# EAGLE schematic EEG_64 (EAGLE 6.6.0)
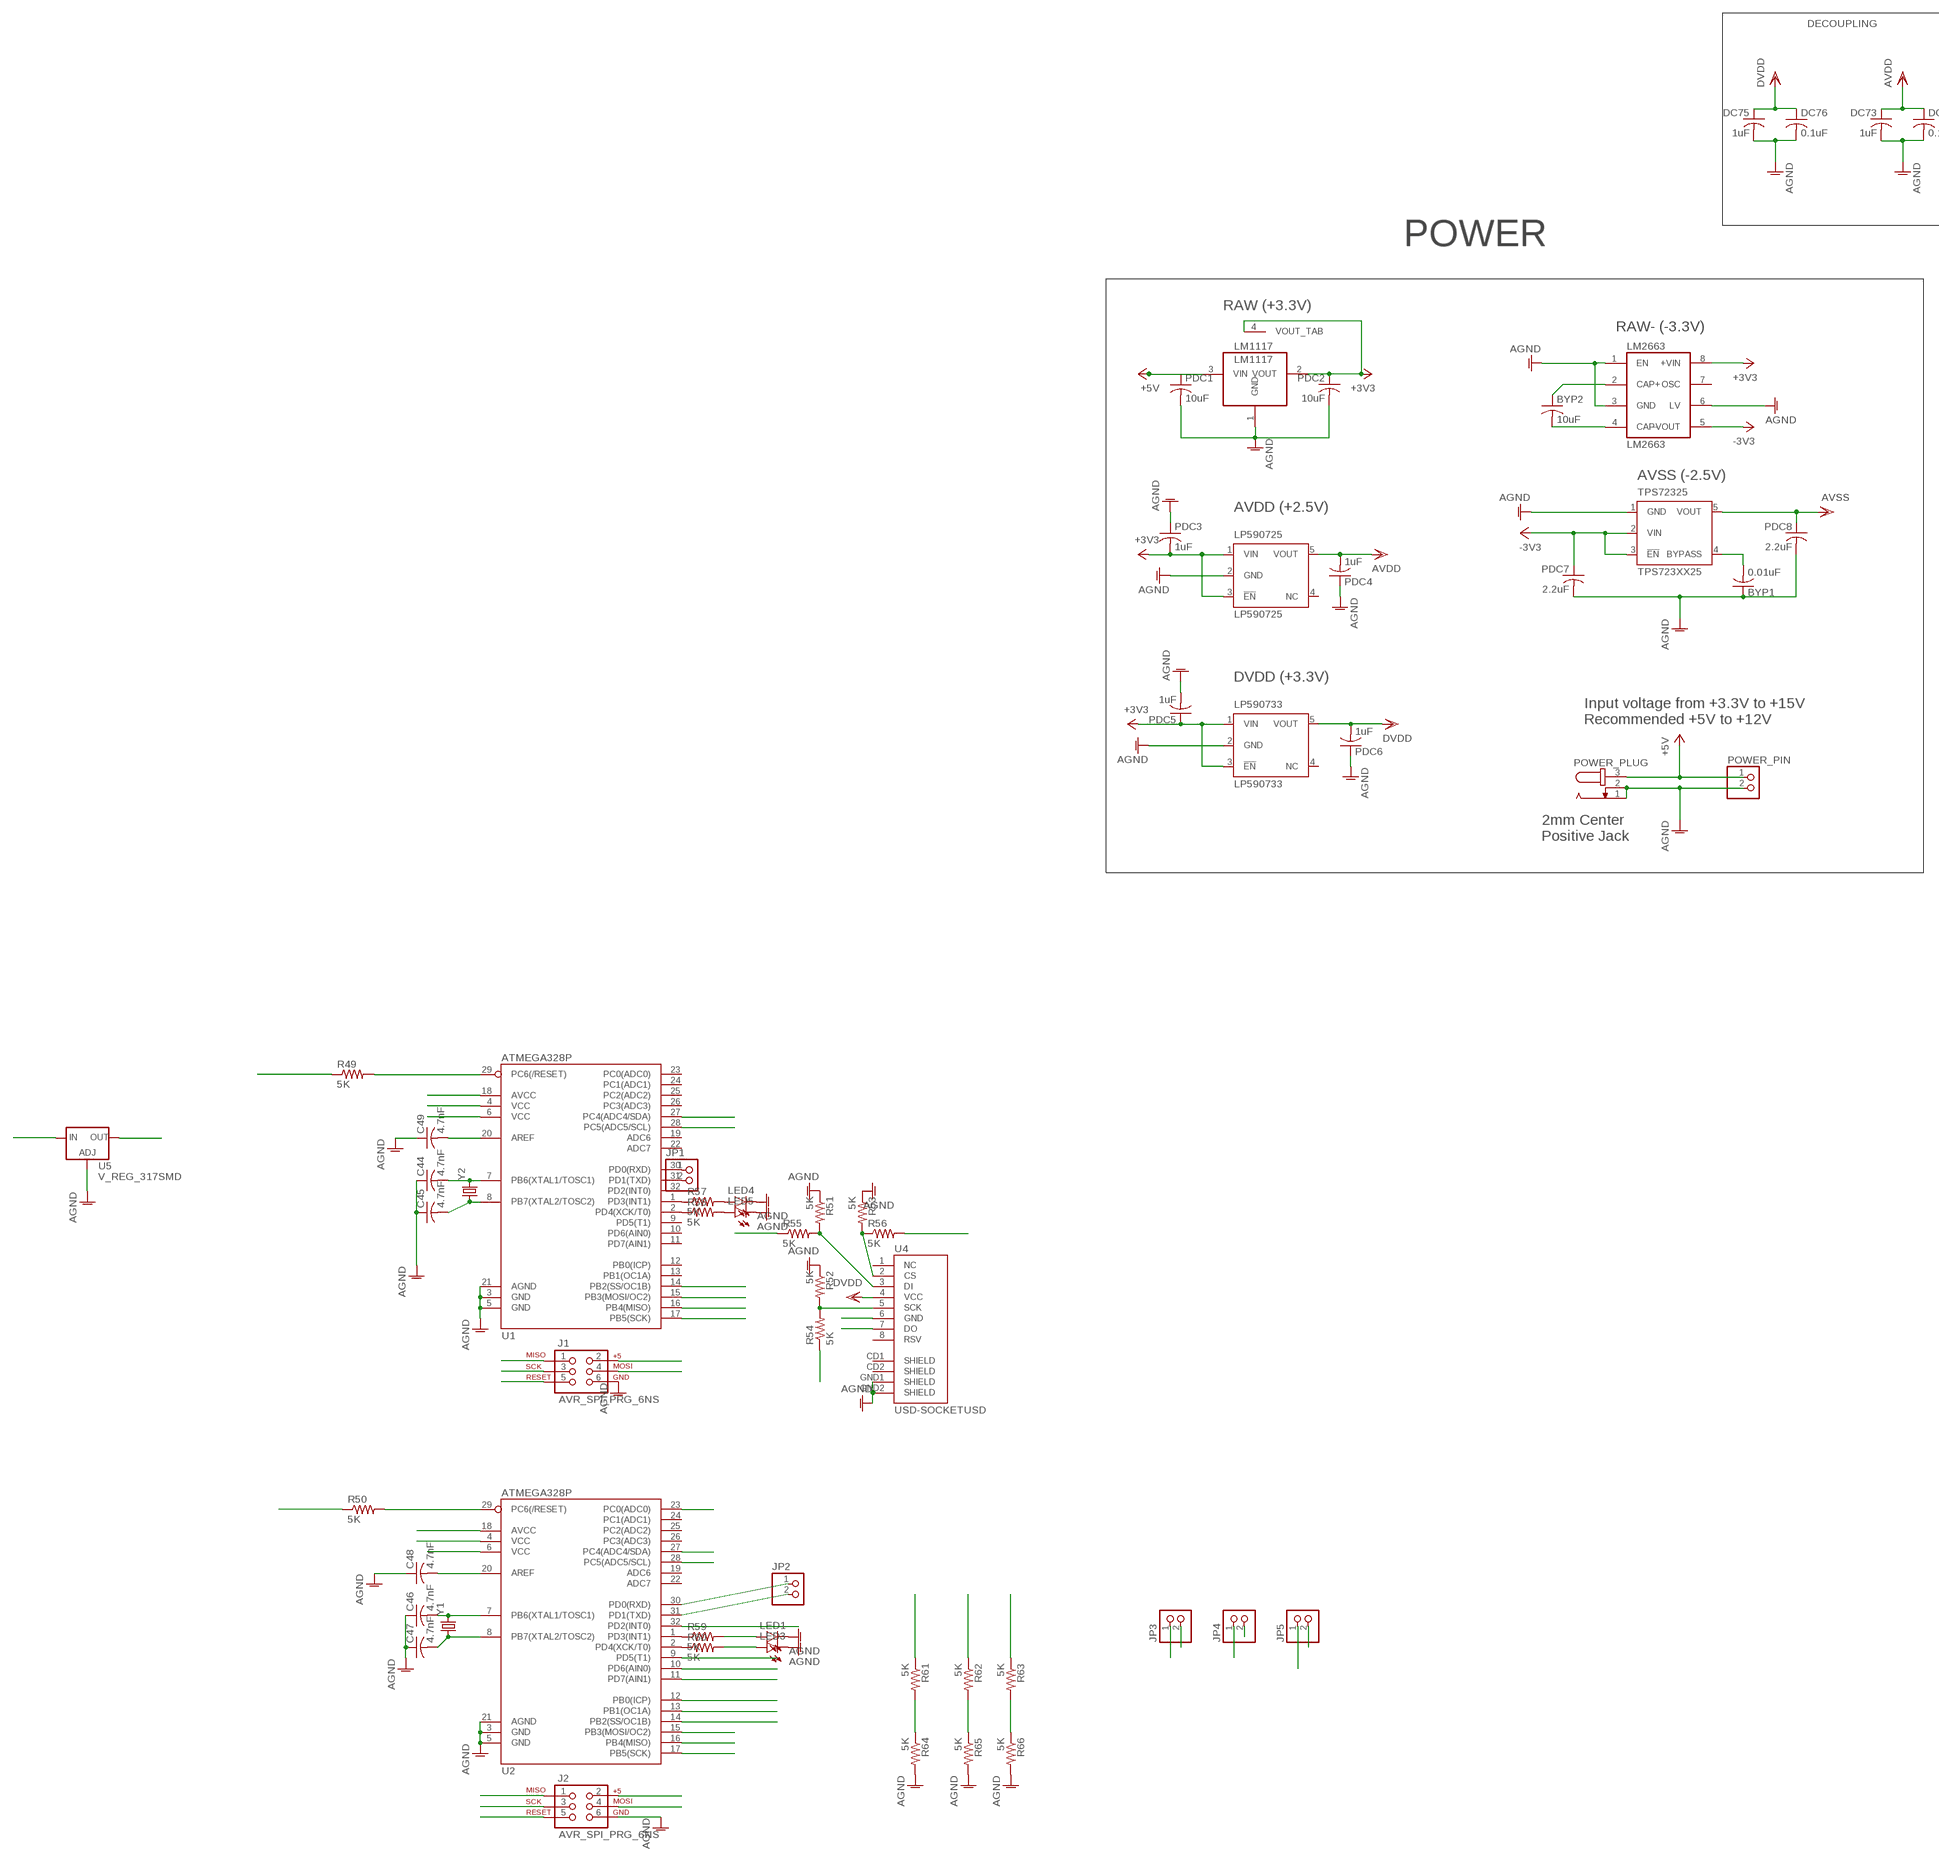
[diagram p0: schematic, sheet 1, part 1 of 3]
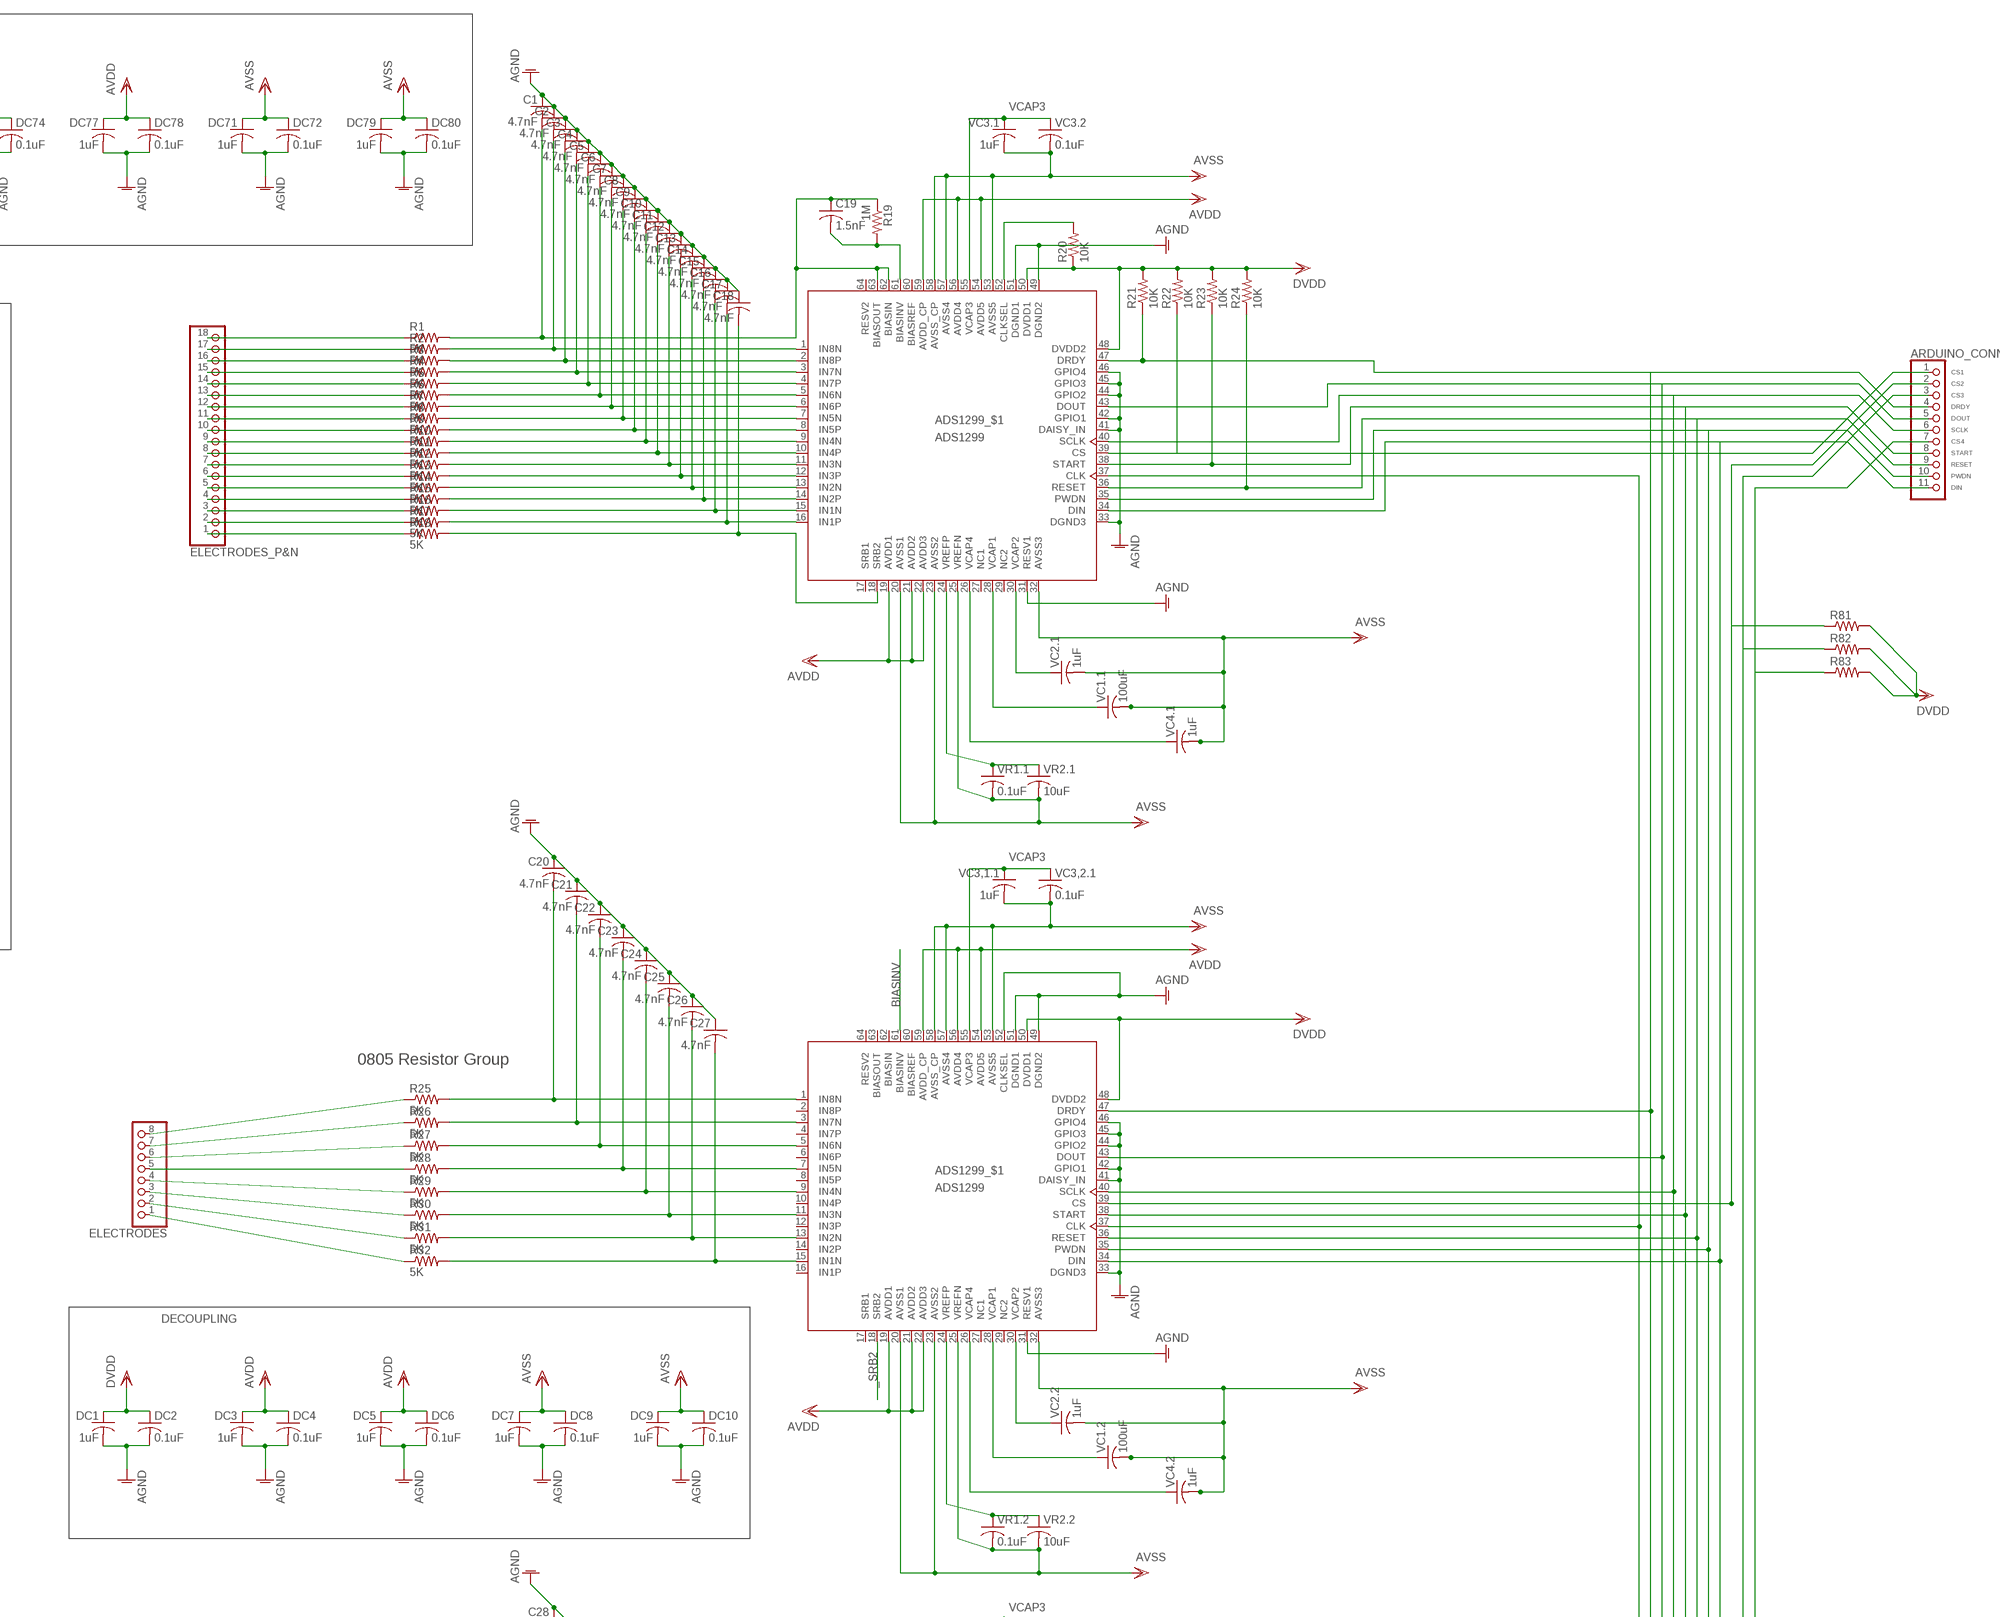
[diagram p1: schematic, sheet 1, part 2 of 3]
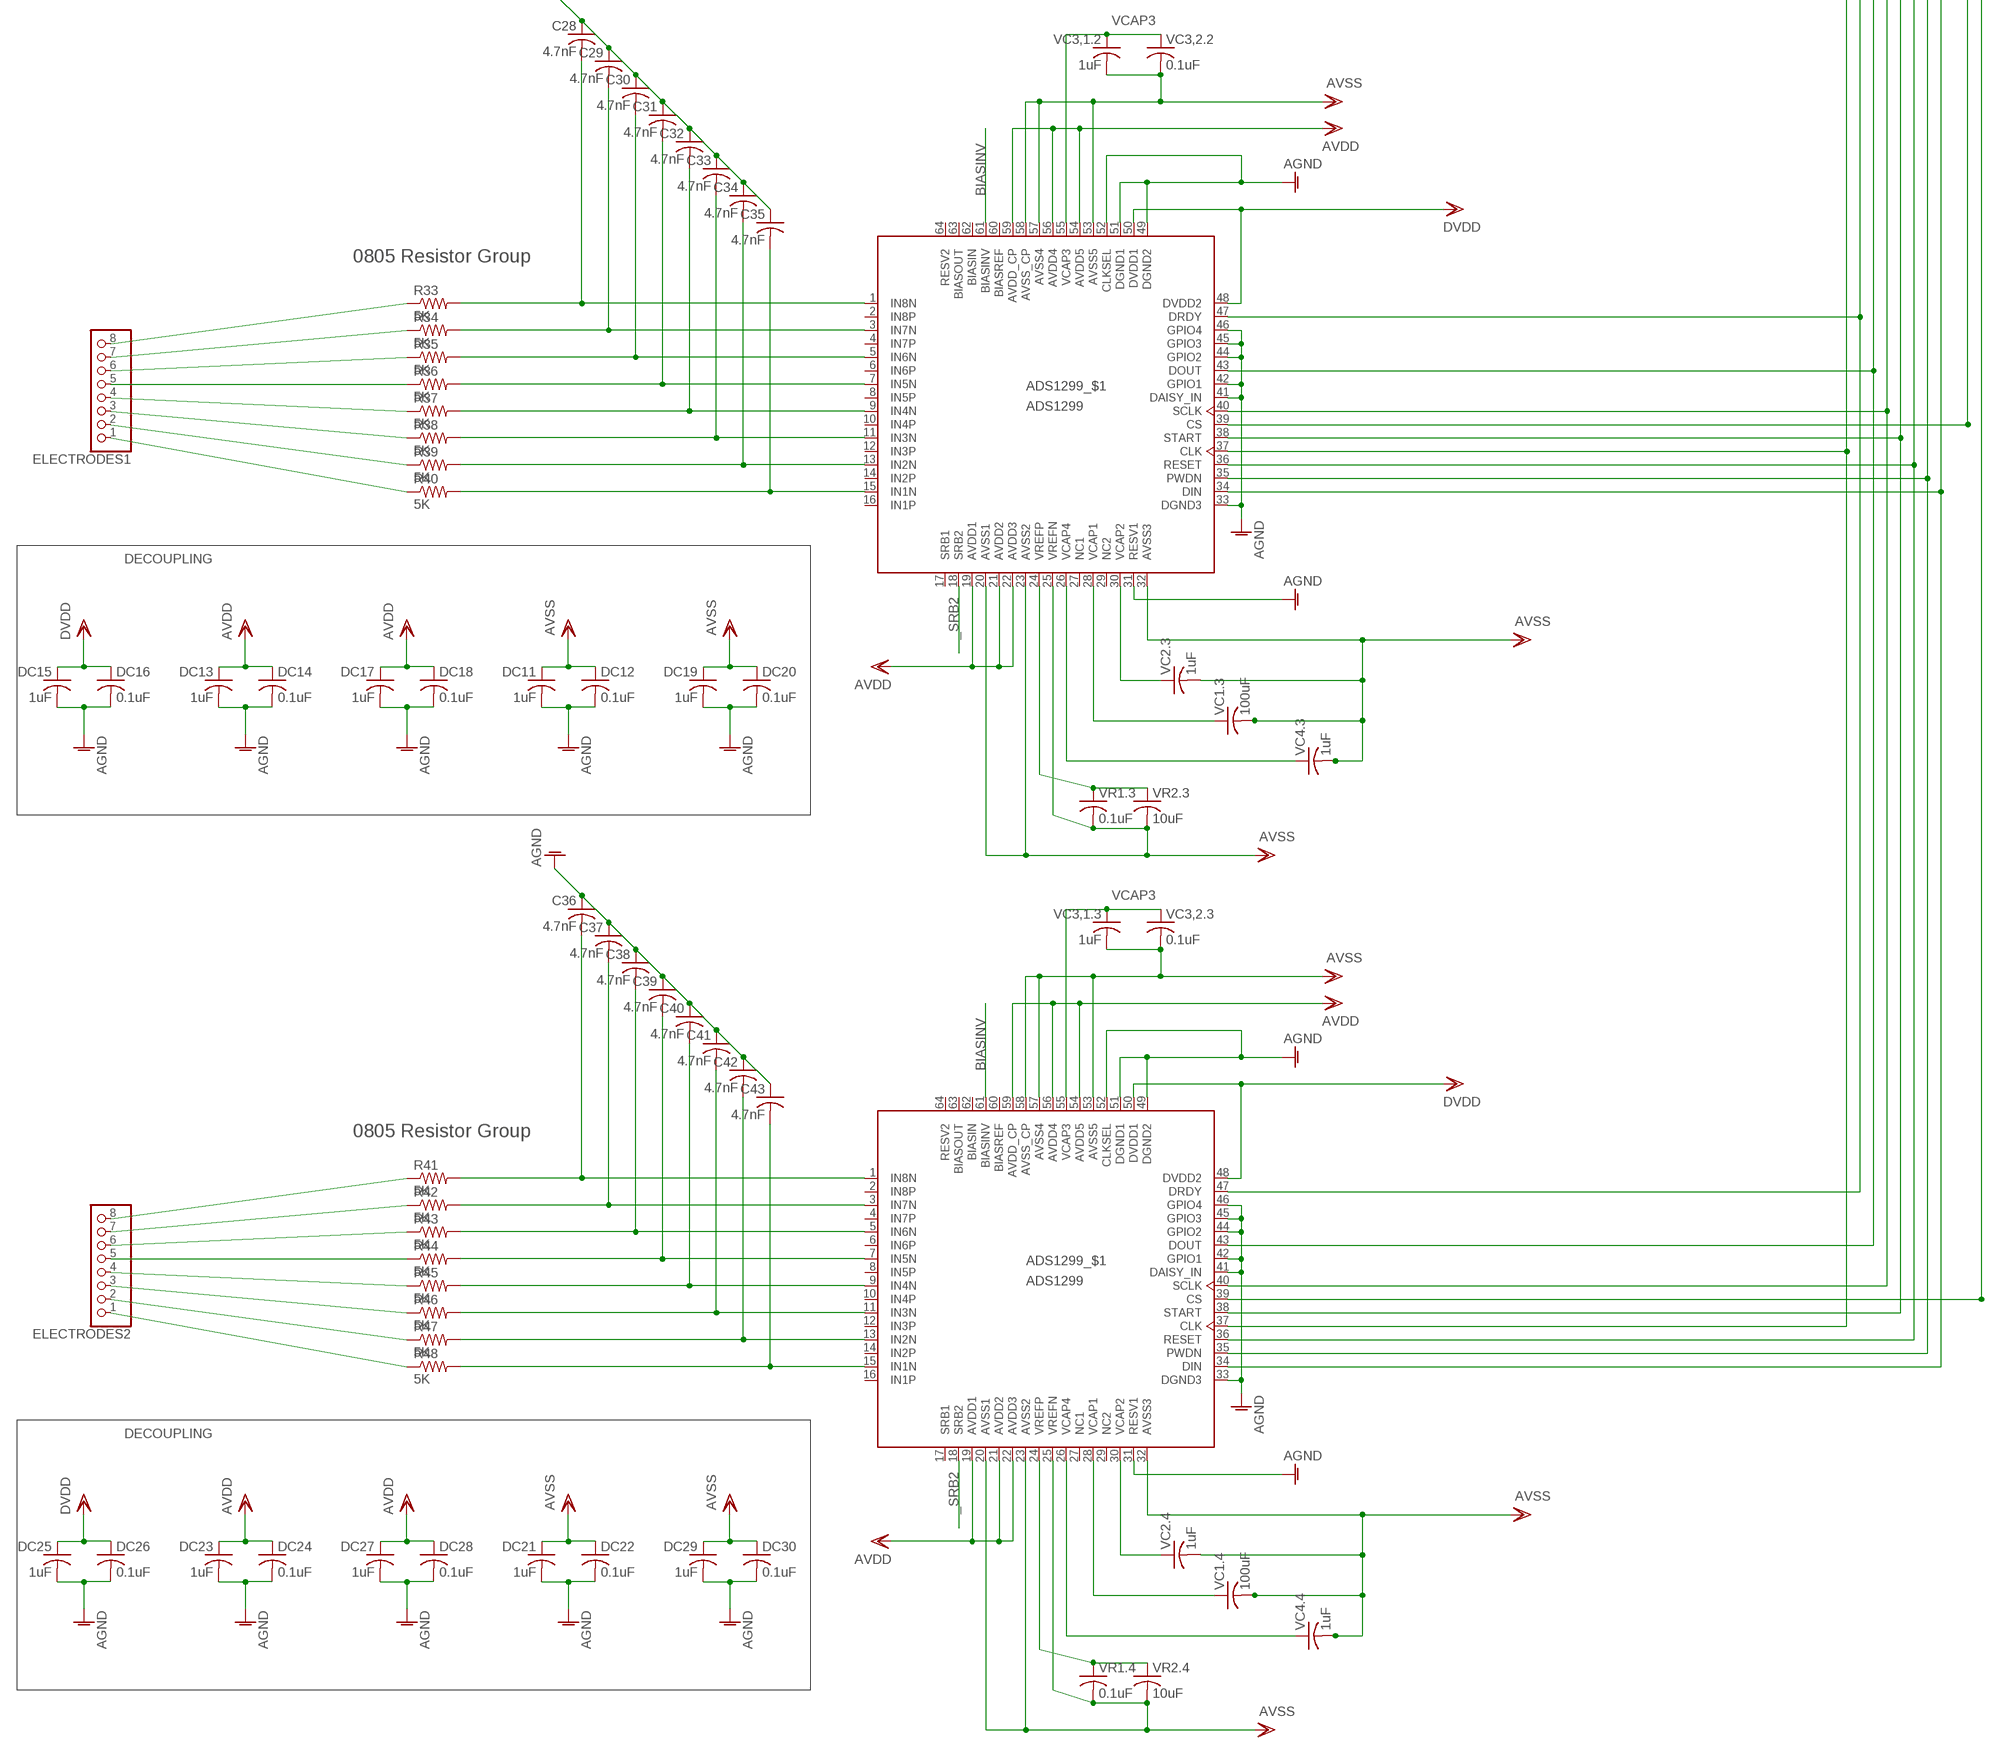
[diagram p2: schematic, sheet 1, part 3 of 3]

## Parts
ADS1  ADS1299  [PAG_S-PQFP-G64]
ADS2  ADS1299  [PAG_S-PQFP-G64]
ADS3  ADS1299  [PAG_S-PQFP-G64]
ADS4  ADS1299  [PAG_S-PQFP-G64]
ARDUINO_CONN  PINHD-1X11  [1X11]
BYP1  0.01uF  C-USC0603  [C0603]
BYP2  10uF  C-USC0603  [C0603]
C1  4.7nF  C-USC0603  [C0603]
C2  4.7nF  C-USC0603  [C0603]
C3  4.7nF  C-USC0603  [C0603]
C4  4.7nF  C-USC0603  [C0603]
C5  4.7nF  C-USC0603  [C0603]
C6  4.7nF  C-USC0603  [C0603]
C7  4.7nF  C-USC0603  [C0603]
C8  4.7nF  C-USC0603  [C0603]
C9  4.7nF  C-USC0603  [C0603]
C10  4.7nF  C-USC0603  [C0603]
C11  4.7nF  C-USC0603  [C0603]
C12  4.7nF  C-USC0603  [C0603]
C13  4.7nF  C-USC0603  [C0603]
C14  4.7nF  C-USC0603  [C0603]
C15  4.7nF  C-USC0603  [C0603]
C16  4.7nF  C-USC0603  [C0603]
C17  4.7nF  C-USC0603  [C0603]
C18  4.7nF  C-USC0603  [C0603]
C19  1.5nF  C-USC0603  [C0603]
C20  4.7nF  C-USC0603  [C0603]
C21  4.7nF  C-USC0603  [C0603]
C22  4.7nF  C-USC0603  [C0603]
C23  4.7nF  C-USC0603  [C0603]
C24  4.7nF  C-USC0603  [C0603]
C25  4.7nF  C-USC0603  [C0603]
C26  4.7nF  C-USC0603  [C0603]
C27  4.7nF  C-USC0603  [C0603]
C28  4.7nF  C-USC0603  [C0603]
C29  4.7nF  C-USC0603  [C0603]
C30  4.7nF  C-USC0603  [C0603]
C31  4.7nF  C-USC0603  [C0603]
C32  4.7nF  C-USC0603  [C0603]
C33  4.7nF  C-USC0603  [C0603]
C34  4.7nF  C-USC0603  [C0603]
C35  4.7nF  C-USC0603  [C0603]
C36  4.7nF  C-USC0603  [C0603]
C37  4.7nF  C-USC0603  [C0603]
C38  4.7nF  C-USC0603  [C0603]
C39  4.7nF  C-USC0603  [C0603]
C40  4.7nF  C-USC0603  [C0603]
C41  4.7nF  C-USC0603  [C0603]
C42  4.7nF  C-USC0603  [C0603]
C43  4.7nF  C-USC0603  [C0603]
C44  4.7nF  C-USC0603  [C0603]
C45  4.7nF  C-USC0603  [C0603]
C46  4.7nF  C-USC0603  [C0603]
C47  4.7nF  C-USC0603  [C0603]
C48  4.7nF  C-USC0603  [C0603]
C49  4.7nF  C-USC0603  [C0603]
DC1  1uF  C-USC0603  [C0603]
DC2  0.1uF  C-USC0603  [C0603]
DC3  1uF  C-USC0603  [C0603]
DC4  0.1uF  C-USC0603  [C0603]
DC5  1uF  C-USC0603  [C0603]
DC6  0.1uF  C-USC0603  [C0603]
DC7  1uF  C-USC0603  [C0603]
DC8  0.1uF  C-USC0603  [C0603]
DC9  1uF  C-USC0603  [C0603]
DC10  0.1uF  C-USC0603  [C0603]
DC11  1uF  C-USC0603  [C0603]
DC12  0.1uF  C-USC0603  [C0603]
DC13  1uF  C-USC0603  [C0603]
DC14  0.1uF  C-USC0603  [C0603]
DC15  1uF  C-USC0603  [C0603]
DC16  0.1uF  C-USC0603  [C0603]
DC17  1uF  C-USC0603  [C0603]
DC18  0.1uF  C-USC0603  [C0603]
DC19  1uF  C-USC0603  [C0603]
DC20  0.1uF  C-USC0603  [C0603]
DC21  1uF  C-USC0603  [C0603]
DC22  0.1uF  C-USC0603  [C0603]
DC23  1uF  C-USC0603  [C0603]
DC24  0.1uF  C-USC0603  [C0603]
DC25  1uF  C-USC0603  [C0603]
DC26  0.1uF  C-USC0603  [C0603]
DC27  1uF  C-USC0603  [C0603]
DC28  0.1uF  C-USC0603  [C0603]
DC29  1uF  C-USC0603  [C0603]
DC30  0.1uF  C-USC0603  [C0603]
DC71  1uF  C-USC0603  [C0603]
DC72  0.1uF  C-USC0603  [C0603]
DC73  1uF  C-USC0603  [C0603]
DC74  0.1uF  C-USC0603  [C0603]
DC75  1uF  C-USC0603  [C0603]
DC76  0.1uF  C-USC0603  [C0603]
DC77  1uF  C-USC0603  [C0603]
DC78  0.1uF  C-USC0603  [C0603]
DC79  1uF  C-USC0603  [C0603]
DC80  0.1uF  C-USC0603  [C0603]
ELECTRODES  PINHD-1X8  [1X08]
ELECTRODES1  PINHD-1X8  [1X08]
ELECTRODES2  PINHD-1X8  [1X08]
ELECTRODES_P&N  PINHD-1X18  [1X18]
J1  AVR_SPI_PRG_6NS  [2X3-NS]
J2  AVR_SPI_PRG_6NS  [2X3-NS]
JP1  PINHD-1X2  [1X02]
JP2  PINHD-1X2  [1X02]
JP3  PINHD-1X2  [1X02]
JP4  PINHD-1X2  [1X02]
JP5  PINHD-1X2  [1X02]
LED1  LED0603  [LED-0603]
LED3  LED0603  [LED-0603]
LED4  LED0603  [LED-0603]
LED5  LED0603  [LED-0603]
LM1117  LM1117  [SOT223]
LM2663  LM2663  [SO-08]
LP590725  LP590725  [SOT23-DBV]
LP590733  LP590733  [SOT23-DBV]
PDC1  10uF  C-USC0603  [C0603]
PDC2  10uF  C-USC0603  [C0603]
PDC3  1uF  C-USC0603  [C0603]
PDC4  1uF  C-USC0603  [C0603]
PDC5  1uF  C-USC0603  [C0603]
PDC6  1uF  C-USC0603  [C0603]
PDC7  2.2uF  C-USC0603  [C0603]
PDC8  2.2uF  C-USC0603  [C0603]
POWER_PIN  PINHD-1X2  [1X02]
POWER_PLUG  JACK-PLUG0  [SPC4077]
R1  5K  R-US_R0603  [R0603]
R2  5K  R-US_R0603  [R0603]
R3  5K  R-US_R0603  [R0603]
R4  5K  R-US_R0603  [R0603]
R5  5K  R-US_R0603  [R0603]
R6  5K  R-US_R0603  [R0603]
R7  5K  R-US_R0603  [R0603]
R8  5K  R-US_R0603  [R0603]
R9  5K  R-US_R0603  [R0603]
R10  5K  R-US_R0603  [R0603]
R11  5K  R-US_R0603  [R0603]
R12  5K  R-US_R0603  [R0603]
R13  5K  R-US_R0603  [R0603]
R14  5K  R-US_R0603  [R0603]
R15  5K  R-US_R0603  [R0603]
R16  5K  R-US_R0603  [R0603]
R17  5K  R-US_R0603  [R0603]
R18  5K  R-US_R0603  [R0603]
R19  1M  R-US_R0603  [R0603]
R20  10K  R-US_R0603  [R0603]
R21  10K  R-US_R0603  [R0603]
R22  10K  R-US_R0603  [R0603]
R23  10K  R-US_R0603  [R0603]
R24  10K  R-US_R0603  [R0603]
R25  5K  R-US_R0603  [R0603]
R26  5K  R-US_R0603  [R0603]
R27  5K  R-US_R0603  [R0603]
R28  5K  R-US_R0603  [R0603]
R29  5K  R-US_R0603  [R0603]
R30  5K  R-US_R0603  [R0603]
R31  5K  R-US_R0603  [R0603]
R32  5K  R-US_R0603  [R0603]
R33  5K  R-US_R0603  [R0603]
R34  5K  R-US_R0603  [R0603]
R35  5K  R-US_R0603  [R0603]
R36  5K  R-US_R0603  [R0603]
R37  5K  R-US_R0603  [R0603]
R38  5K  R-US_R0603  [R0603]
R39  5K  R-US_R0603  [R0603]
R40  5K  R-US_R0603  [R0603]
R41  5K  R-US_R0603  [R0603]
R42  5K  R-US_R0603  [R0603]
R43  5K  R-US_R0603  [R0603]
R44  5K  R-US_R0603  [R0603]
R45  5K  R-US_R0603  [R0603]
R46  5K  R-US_R0603  [R0603]
R47  5K  R-US_R0603  [R0603]
R48  5K  R-US_R0603  [R0603]
R49  5K  R-US_R0603  [R0603]
R50  5K  R-US_R0603  [R0603]
R51  5K  R-US_R0603  [R0603]
R52  5K  R-US_R0603  [R0603]
R53  5K  R-US_R0603  [R0603]
R54  5K  R-US_R0603  [R0603]
R55  5K  R-US_R0603  [R0603]
R56  5K  R-US_R0603  [R0603]
R57  5K  R-US_R0603  [R0603]
R58  5K  R-US_R0603  [R0603]
R59  5K  R-US_R0603  [R0603]
R60  5K  R-US_R0603  [R0603]
R61  5K  R-US_R0603  [R0603]
R62  5K  R-US_R0603  [R0603]
R63  5K  R-US_R0603  [R0603]
R64  5K  R-US_R0603  [R0603]
R65  5K  R-US_R0603  [R0603]
R66  5K  R-US_R0603  [R0603]
R81  R-US_R0603  [R0603]
R82  R-US_R0603  [R0603]
R83  R-US_R0603  [R0603]
TPS72325  TPS723XX25  [SOT23-DBV]
U1  ATMEGA328P  ATMEGA328_SMT  [TQFP32-08]
U2  ATMEGA328P  ATMEGA328_SMT  [TQFP32-08]
U4  USD-SOCKETUSD  [USD-SOCKET-PP]
U5  V_REG_317SMD  [SOT223]
VC1.1  100uF  C-USC0603  [C0603]
VC1.2  100uF  C-USC0603  [C0603]
VC1.3  100uF  C-USC0603  [C0603]
VC1.4  100uF  C-USC0603  [C0603]
VC2.1  1uF  C-USC0603  [C0603]
VC2.2  1uF  C-USC0603  [C0603]
VC2.3  1uF  C-USC0603  [C0603]
VC2.4  1uF  C-USC0603  [C0603]
VC3,1.1  1uF  C-USC0603  [C0603]
VC3,1.2  1uF  C-USC0603  [C0603]
VC3,1.3  1uF  C-USC0603  [C0603]
VC3,2.1  0.1uF  C-USC0603  [C0603]
VC3,2.2  0.1uF  C-USC0603  [C0603]
VC3,2.3  0.1uF  C-USC0603  [C0603]
VC3.1  1uF  C-USC0603  [C0603]
VC3.2  0.1uF  C-USC0603  [C0603]
VC4.1  1uF  C-USC0603  [C0603]
VC4.2  1uF  C-USC0603  [C0603]
VC4.3  1uF  C-USC0603  [C0603]
VC4.4  1uF  C-USC0603  [C0603]
VR1.1  0.1uF  C-USC0603  [C0603]
VR1.2  0.1uF  C-USC0603  [C0603]
VR1.3  0.1uF  C-USC0603  [C0603]
VR1.4  0.1uF  C-USC0603  [C0603]
VR2.1  10uF  C-USC0603  [C0603]
VR2.2  10uF  C-USC0603  [C0603]
VR2.3  10uF  C-USC0603  [C0603]
VR2.4  10uF  C-USC0603  [C0603]
Y1  CRYSTAL5X3  [CRYSTAL-SMD-5X3]
Y2  CRYSTAL5X3  [CRYSTAL-SMD-5X3]

## Nets
+3V3: LM1117.2(VOUT) LM1117.4(VOUT_TAB) LM2663.8(+VIN) LP590725.1(VIN) LP590725.3(!EN) LP590733.1(VIN) LP590733.3(!EN) PDC2.1 PDC3.2 PDC5.1
+5V: LM1117.3(VIN) PDC1.1 POWER_PIN.1 POWER_PLUG.3 U5.3(IN)
-3V3: LM2663.5(-VOUT) PDC7.1 TPS72325.2(VIN) TPS72325.3(!EN)
_1IN1: ADS2.15(IN1N) C27.2 R32.2
_1IN2: ADS3.15(IN1N) C35.2 R40.2
_1IN3: ADS4.15(IN1N) C43.2 R48.2
_1O1: ELECTRODES.1 R32.1
_1O2: ELECTRODES1.1 R40.1
_1O3: ELECTRODES2.1 R48.1
_2IN1: ADS2.13(IN2N) C26.2 R31.2
_2IN2: ADS3.13(IN2N) C34.2 R39.2
_2IN3: ADS4.13(IN2N) C42.2 R47.2
_2O1: ELECTRODES.2 R31.1
_2O2: ELECTRODES1.2 R39.1
_2O3: ELECTRODES2.2 R47.1
_3IN1: ADS2.11(IN3N) C25.2 R30.2
_3IN2: ADS3.11(IN3N) C33.2 R38.2
_3IN3: ADS4.11(IN3N) C41.2 R46.2
_3O1: ELECTRODES.3 R30.1
_3O2: ELECTRODES1.3 R38.1
_3O3: ELECTRODES2.3 R46.1
_4IN1: ADS2.9(IN4N) C24.2 R29.2
_4IN2: ADS3.9(IN4N) C32.2 R37.2
_4IN3: ADS4.9(IN4N) C40.2 R45.2
_4O1: ELECTRODES.4 R29.1
_4O2: ELECTRODES1.4 R37.1
_4O3: ELECTRODES2.4 R45.1
_5IN1: ADS2.7(IN5N) C23.2 R28.2
_5IN2: ADS3.7(IN5N) C31.2 R36.2
_5IN3: ADS4.7(IN5N) C39.2 R44.2
_5O1: ELECTRODES.5 R28.1
_5O2: ELECTRODES1.5 R36.1
_5O3: ELECTRODES2.5 R44.1
_6IN1: ADS2.5(IN6N) C22.2 R27.2
_6IN2: ADS3.5(IN6N) C30.2 R35.2
_6IN3: ADS4.5(IN6N) C38.2 R43.2
_6O1: ELECTRODES1.6 R35.1
_6O2: ELECTRODES.6 R27.1
_6O3: ELECTRODES2.6 R43.1
_7IN1: ADS2.3(IN7N) C21.2 R26.2
_7IN2: ADS3.3(IN7N) C29.2 R34.2
_7IN3: ADS4.3(IN7N) C37.2 R42.2
_7O1: ELECTRODES.7 R26.1
_7O2: ELECTRODES1.7 R34.1
_7O3: ELECTRODES2.7 R42.1
_8IN1: ADS2.1(IN8N) C20.2 R25.2
_8IN2: ADS3.1(IN8N) C28.2 R33.2
_8IN3: ADS4.1(IN8N) C36.2 R41.2
_8O1: ELECTRODES.8 R25.1
_8O2: ELECTRODES1.8 R33.1
_8O3: ELECTRODES2.8 R41.1
_CLK: ADS1.37(CLK) ADS2.37(CLK) ADS3.37(CLK) ADS4.37(CLK)
_CS1: ADS1.39(CS) ARDUINO_CONN.1 R22.1 U2.11(PD7(AIN1))
_CS2: ADS2.39(CS) ARDUINO_CONN.2 R81.1 U2.12(PB0(ICP))
_CS3: ADS3.39(CS) ARDUINO_CONN.3 R82.1 U2.13(PB1(OC1A))
_CS4: ADS4.39(CS) ARDUINO_CONN.7 R83.1 U2.14(PB2(SS/OC1B))
_DIN: ADS1.34(DIN) ADS2.34(DIN) ADS3.34(DIN) ADS4.34(DIN) ARDUINO_CONN.11 JP3.2
_DOUT: ADS1.43(DOUT) ADS2.43(DOUT) ADS3.43(DOUT) ADS4.43(DOUT) ARDUINO_CONN.5 JP4.2
_DRDY: ADS1.47(DRDY) ADS2.47(DRDY) ADS3.47(DRDY) ADS4.47(DRDY) ARDUINO_CONN.4 R21.1 U2.10(PD6(AIN0))
_PD: ADS1.35(PWDN) ADS2.35(PWDN) ADS3.35(PWDN) ADS4.35(PWDN) ARDUINO_CONN.10 U2.23(PC0(ADC0))
_RST: ADS1.36(RESET) ADS2.36(RESET) ADS3.36(RESET) ADS4.36(RESET) ARDUINO_CONN.9 R24.1 U2.32(PD2(INT0))
_SCLK: ADS1.40(SCLK) ADS2.40(SCLK) ADS3.40(SCLK) ADS4.40(SCLK) ARDUINO_CONN.6 JP5.2
_SRB2: ADS1.18(SRB2) ADS2.18(SRB2) ADS3.18(SRB2) ADS4.18(SRB2) C18.2 R18.2
_STRT: ADS1.38(START) ADS2.38(START) ADS3.38(START) ADS4.38(START) ARDUINO_CONN.8 R23.1 U2.9(PD5(T1))
_VC1.1: ADS2.28(VCAP1) VC1.2.1
_VC1.2: ADS3.28(VCAP1) VC1.3.1
_VC1.3: ADS4.28(VCAP1) VC1.4.1
_VC2.1: ADS2.30(VCAP2) VC2.2.1
_VC2.2: ADS3.30(VCAP2) VC2.3.1
_VC2.3: ADS4.30(VCAP2) VC2.4.1
_VC3.1: ADS2.55(VCAP3) VC3,1.1.1 VC3,2.1.1
_VC3.2: ADS3.55(VCAP3) VC3,1.2.1 VC3,2.2.1
_VC3.3: ADS4.55(VCAP3) VC3,1.3.1 VC3,2.3.1
_VC4.1: ADS2.26(VCAP4) VC4.2.1
_VC4.2: ADS3.26(VCAP4) VC4.3.1
_VC4.3: ADS4.26(VCAP4) VC4.4.1
_VRP1: ADS2.24(VREFP) VR1.2.1 VR2.2.1
_VRP2: ADS3.24(VREFP) VR1.3.1 VR2.3.1
_VRP3: ADS4.24(VREFP) VR1.4.1 VR2.4.1
AGND: ADS1.31(RESV1) ADS1.33(DGND3) ADS1.41(DAISY_IN) ADS1.42(GPIO1) ADS1.44(GPIO2) ADS1.45(GPIO3) ADS1.46(GPIO4) ADS1.49(DGND2) ADS1.51(DGND1) ADS2.31(RESV1) ADS2.33(DGND3) ADS2.41(DAISY_IN) ADS2.42(GPIO1) ADS2.44(GPIO2) ADS2.45(GPIO3) ADS2.46(GPIO4) ADS2.49(DGND2) ADS2.51(DGND1) ADS2.52(CLKSEL) ADS3.31(RESV1) ADS3.33(DGND3) ADS3.41(DAISY_IN) ADS3.42(GPIO1) ADS3.44(GPIO2) ADS3.45(GPIO3) ADS3.46(GPIO4) ADS3.49(DGND2) ADS3.51(DGND1) ADS3.52(CLKSEL) ADS4.31(RESV1) ADS4.33(DGND3) ADS4.41(DAISY_IN) ADS4.42(GPIO1) ADS4.44(GPIO2) ADS4.45(GPIO3) ADS4.46(GPIO4) ADS4.49(DGND2) ADS4.51(DGND1) ADS4.52(CLKSEL) BYP1.1 C1.1 C2.1 C3.1 C4.1 C5.1 C6.1 C7.1 C8.1 C9.1 C10.1 C11.1 C12.1 C13.1 C14.1 C15.1 C16.1 C17.1 C18.1 C20.1 C21.1 C22.1 C23.1 C24.1 C25.1 C26.1 C27.1 C28.1 C29.1 C30.1 C31.1 C32.1 C33.1 C34.1 C35.1 C36.1 C37.1 C38.1 C39.1 C40.1 C41.1 C42.1 C43.1 C44.1 C45.1 C46.1 C47.1 C48.1 C49.1 DC1.2 DC2.2 DC3.2 DC4.2 DC5.2 DC6.2 DC7.2 DC8.2 DC9.2 DC10.2 DC11.2 DC12.2 DC13.2 DC14.2 DC15.2 DC16.2 DC17.2 DC18.2 DC19.2 DC20.2 DC21.2 DC22.2 DC23.2 DC24.2 DC25.2 DC26.2 DC27.2 DC28.2 DC29.2 DC30.2 DC71.2 DC72.2 DC73.2 DC74.2 DC75.2 DC76.2 DC77.2 DC78.2 DC79.2 DC80.2 J1.6 J2.6 LED1.C LED3.C LED4.C LED5.C LM1117.1(GND) LM2663.1(EN) LM2663.3(GND) LM2663.6(LV) LP590725.2(GND) LP590733.2(GND) PDC1.2 PDC2.2 PDC3.1 PDC4.1 PDC5.2 PDC6.1 PDC7.2 PDC8.2 POWER_PIN.2 POWER_PLUG.1 POWER_PLUG.2 R51.1 R52.1 R53.1 R64.2 R65.2 R66.2 TPS72325.1(GND) U1.3(GND) U1.5(GND) U1.21(AGND) U2.3(GND) U2.5(GND) U2.21(AGND) U4.GND1(SHIELD) U4.GND2(SHIELD) U5.1(ADJ)
AVDD: ADS1.19(AVDD1) ADS1.21(AVDD2) ADS1.22(AVDD3) ADS1.54(AVDD5) ADS1.56(AVDD4) ADS1.59(AVDD_CP) ADS2.19(AVDD1) ADS2.21(AVDD2) ADS2.22(AVDD3) ADS2.54(AVDD5) ADS2.56(AVDD4) ADS2.59(AVDD_CP) ADS3.19(AVDD1) ADS3.21(AVDD2) ADS3.22(AVDD3) ADS3.54(AVDD5) ADS3.56(AVDD4) ADS3.59(AVDD_CP) ADS4.19(AVDD1) ADS4.21(AVDD2) ADS4.22(AVDD3) ADS4.54(AVDD5) ADS4.56(AVDD4) ADS4.59(AVDD_CP) DC3.1 DC4.1 DC5.1 DC6.1 DC13.1 DC14.1 DC17.1 DC18.1 DC23.1 DC24.1 DC27.1 DC28.1 DC73.1 DC74.1 DC77.1 DC78.1 LP590725.5(VOUT) PDC4.2
AVSS: ADS1.20(AVSS1) ADS1.23(AVSS2) ADS1.25(VREFN) ADS1.32(AVSS3) ADS1.53(AVSS5) ADS1.57(AVSS4) ADS1.58(AVSS_CP) ADS2.20(AVSS1) ADS2.23(AVSS2) ADS2.25(VREFN) ADS2.32(AVSS3) ADS2.53(AVSS5) ADS2.57(AVSS4) ADS2.58(AVSS_CP) ADS3.20(AVSS1) ADS3.23(AVSS2) ADS3.25(VREFN) ADS3.32(AVSS3) ADS3.53(AVSS5) ADS3.57(AVSS4) ADS3.58(AVSS_CP) ADS4.20(AVSS1) ADS4.23(AVSS2) ADS4.25(VREFN) ADS4.32(AVSS3) ADS4.53(AVSS5) ADS4.57(AVSS4) ADS4.58(AVSS_CP) DC7.1 DC8.1 DC9.1 DC10.1 DC11.1 DC12.1 DC19.1 DC20.1 DC21.1 DC22.1 DC29.1 DC30.1 DC71.1 DC72.1 DC79.1 DC80.1 PDC8.1 TPS72325.5(VOUT) VC1.1.2 VC1.2.2 VC1.3.2 VC1.4.2 VC2.1.2 VC2.2.2 VC2.3.2 VC2.4.2 VC3,1.1.2 VC3,1.2.2 VC3,1.3.2 VC3,2.1.2 VC3,2.2.2 VC3,2.3.2 VC3.1.2 VC3.2.2 VC4.1.2 VC4.2.2 VC4.3.2 VC4.4.2 VR1.1.2 VR1.2.2 VR1.3.2 VR1.4.2 VR2.1.2 VR2.2.2 VR2.3.2 VR2.4.2
BIASINV: ADS1.61(BIASINV) ADS2.61(BIASINV) ADS3.61(BIASINV) ADS4.61(BIASINV) C19.2 R19.2
CLK: U1.28(PC5(ADC5/SCL)) U2.28(PC5(ADC5/SCL))
CS: R56.2 U1.14(PB2(SS/OC1B))
DVDD: ADS1.48(DVDD2) ADS1.50(DVDD1) ADS2.48(DVDD2) ADS2.50(DVDD1) ADS3.48(DVDD2) ADS3.50(DVDD1) ADS4.48(DVDD2) ADS4.50(DVDD1) DC1.1 DC2.1 DC15.1 DC16.1 DC25.1 DC26.1 DC75.1 DC76.1 LP590733.5(VOUT) PDC6.2 R20.1 R21.2 R22.2 R23.2 R24.2 R81.2 R82.2 R83.2 U4.4(VCC)
JU1: JP3.1 R61.2 R64.1
JU2: JP4.1 R62.2 R65.1
JU3: JP5.1 R63.2 R66.1
MISO1: J1.1 U1.16(PB4(MISO)) U4.7(DO)
MISO2: J2.1 R62.1 U2.16(PB4(MISO))
MOSI1: J1.4 R55.1 U1.15(PB3(MOSI/OC2))
MOSI2: J2.4 R61.1 U2.15(PB3(MOSI/OC2))
N$1: ADS1.62(BIASIN) ADS1.63(BIASOUT) C1.2 C19.1 R1.2 R19.1
N$2: JP1.1 U1.30(PD0(RXD))
N$3: ADS1.2(IN8P) C3.2 R3.2
N$4: ADS1.55(VCAP3) VC3.1.1 VC3.2.1
N$5: ADS1.3(IN7N) C4.2 R4.2
N$6: ADS1.1(IN8N) C2.2 R2.2
N$7: ADS1.4(IN7P) C5.2 R5.2
N$8: ADS1.5(IN6N) C6.2 R6.2
N$9: ADS1.6(IN6P) C7.2 R7.2
N$10: ADS1.7(IN5N) C8.2 R8.2
N$11: ADS1.8(IN5P) C9.2 R9.2
N$12: ADS1.9(IN4N) C10.2 R10.2
N$13: ADS1.10(IN4P) C11.2 R11.2
N$14: ADS1.11(IN3N) C12.2 R12.2
N$15: ADS1.12(IN3P) C13.2 R13.2
N$16: ADS1.13(IN2N) C14.2 R14.2
N$17: ADS1.14(IN2P) C15.2 R15.2
N$18: ADS1.15(IN1N) C16.2 R16.2
N$19: ADS1.16(IN1P) C17.2 R17.2
N$20: U4.6(GND)
N$21: C44.2 U1.7(PB6(XTAL1/TOSC1)) Y2.3
N$24: C45.2 U1.8(PB7(XTAL2/TOSC2)) Y2.1
N$26: C46.2 U2.7(PB6(XTAL1/TOSC1)) Y1.3
N$27: C47.2 U2.8(PB7(XTAL2/TOSC2)) Y1.1
N$28: C48.2 U2.20(AREF)
N$29: ADS1.52(CLKSEL) R20.2
N$30: ADS1.24(VREFP) VR1.1.1 VR2.1.1
N$31: ADS1.26(VCAP4) VC4.1.1
N$32: ADS1.28(VCAP1) VC1.1.1
N$33: ADS1.30(VCAP2) VC2.1.1
N$34: BYP1.2 TPS72325.4(BYPASS)
N$35: BYP2.1 LM2663.2(CAP+)
N$36: BYP2.2 LM2663.4(CAP-)
N$37: ELECTRODES_P&N.18 R1.1
N$38: ELECTRODES_P&N.17 R2.1
N$39: ELECTRODES_P&N.16 R3.1
N$40: ELECTRODES_P&N.15 R4.1
N$41: ELECTRODES_P&N.14 R5.1
N$42: ELECTRODES_P&N.13 R6.1
N$43: ELECTRODES_P&N.12 R7.1
N$44: ELECTRODES_P&N.11 R8.1
N$45: ELECTRODES_P&N.10 R9.1
N$46: ELECTRODES_P&N.9 R10.1
N$47: ELECTRODES_P&N.8 R11.1
N$48: ELECTRODES_P&N.7 R12.1
N$49: ELECTRODES_P&N.6 R13.1
N$50: ELECTRODES_P&N.5 R14.1
N$51: ELECTRODES_P&N.4 R15.1
N$52: ELECTRODES_P&N.3 R16.1
N$53: ELECTRODES_P&N.2 R17.1
N$54: ELECTRODES_P&N.1 R18.1
N$55: C49.2 U1.20(AREF)
N$56: R51.2 R55.2 U4.3(DI)
N$57: R52.2 R54.2 U4.5(SCK)
N$58: R53.2 R56.1 U4.2(CS)
N$59: JP1.2 U1.31(PD1(TXD))
N$60: JP2.1 U2.30(PD0(RXD))
N$61: JP2.2 U2.31(PD1(TXD))
N$62: R57.1 U1.1(PD3(INT1))
N$63: R58.1 U1.2(PD4(XCK/T0))
N$64: R59.1 U2.1(PD3(INT1))
N$65: R60.1 U2.2(PD4(XCK/T0))
N$66: LED1.A R59.2
N$68: LED3.A R60.2
N$69: LED4.A R57.2
N$70: LED5.A R58.2
OUT: J1.2 J2.2 R49.1 R50.1 U1.4(VCC) U1.6(VCC) U1.18(AVCC) U2.4(VCC) U2.6(VCC) U2.18(AVCC) U5.2(OUT)
RST1: J1.5 R49.2 U1.29(PC6(/RESET))
RST2: J2.5 R50.2 U2.29(PC6(/RESET))
SCK1: J1.3 R54.1 U1.17(PB5(SCK))
SCK2: J2.3 R63.1 U2.17(PB5(SCK))
SDA: U1.27(PC4(ADC4/SDA)) U2.27(PC4(ADC4/SDA))
Unconnected: ADS1.17(SRB1) ADS1.27(NC1) ADS1.29(NC2) ADS1.60(BIASREF) ADS1.64(RESV2) ADS2.2(IN8P) ADS2.4(IN7P) ADS2.6(IN6P) ADS2.8(IN5P) ADS2.10(IN4P) ADS2.12(IN3P) ADS2.14(IN2P) ADS2.16(IN1P) ADS2.17(SRB1) ADS2.27(NC1) ADS2.29(NC2) ADS2.60(BIASREF) ADS2.62(BIASIN) ADS2.63(BIASOUT) ADS2.64(RESV2) ADS3.2(IN8P) ADS3.4(IN7P) ADS3.6(IN6P) ADS3.8(IN5P) ADS3.10(IN4P) ADS3.12(IN3P) ADS3.14(IN2P) ADS3.16(IN1P) ADS3.17(SRB1) ADS3.27(NC1) ADS3.29(NC2) ADS3.60(BIASREF) ADS3.62(BIASIN) ADS3.63(BIASOUT) ADS3.64(RESV2) ADS4.2(IN8P) ADS4.4(IN7P) ADS4.6(IN6P) ADS4.8(IN5P) ADS4.10(IN4P) ADS4.12(IN3P) ADS4.14(IN2P) ADS4.16(IN1P) ADS4.17(SRB1) ADS4.27(NC1) ADS4.29(NC2) ADS4.60(BIASREF) ADS4.62(BIASIN) ADS4.63(BIASOUT) ADS4.64(RESV2) LM2663.7(OSC) LP590725.4(NC) LP590733.4(NC) U1.9(PD5(T1)) U1.10(PD6(AIN0)) U1.11(PD7(AIN1)) U1.12(PB0(ICP)) U1.13(PB1(OC1A)) U1.19(ADC6) U1.22(ADC7) U1.23(PC0(ADC0)) U1.24(PC1(ADC1)) U1.25(PC2(ADC2)) U1.26(PC3(ADC3)) U1.32(PD2(INT0)) U2.19(ADC6) U2.22(ADC7) U2.24(PC1(ADC1)) U2.25(PC2(ADC2)) U2.26(PC3(ADC3)) U4.1(NC) U4.8(RSV) U4.CD1(SHIELD) U4.CD2(SHIELD)

## Notes on the sheet
- DECOUPLING
- VCAP3
- POWER
- RAW (+3.3V)
- RAW- (-3.3V)
- CS1
- CS2
- CS3
- DRDY
- DOUT
- SCLK
- CS4
- START
- RESET
- PWDN
- DIN
- AVSS (-2.5V)
- AVDD (+2.5V)
- DVDD (+3.3V)
- Input voltage from +3.3V to +15V
  Recommended +5V to +12V
- VCAP3
- 2mm Center
  Positive Jack
- 0805 Resistor Group
- DECOUPLING
- VCAP3
- 0805 Resistor Group
- DECOUPLING
- VCAP3
- 0805 Resistor Group
- DECOUPLING

## Library data of the parts
ADS1-ADS4 = ads1299:ADS1299: Low-Noise, 8-Channel, 24-Bit Analog Front-End for Biopotential Measurements Auto generated by make-symbol-device-package-bsdl.ulp Rev. 29 Source: http://www.ti.com/lit/ds/symlink/ads1299.pdf; MF: TEXAS INSTRUMENTS; MPN: ADS1299PAGR
ARDUINO_CONN = pinhead:PINHD-1X11: PIN HEADER
BYP1 BYP2 C1-C19 PDC1-PDC8 VC1.1 VC2.1 VC3.1 VC3.2 VC4.1 VR1.1 VR2.1 = resistor:C-US: CAPACITOR, American symbol
C20-C49 DC1-DC30 DC71-DC80 VC1.2-VC1.4 VC2.2-VC2.4 VC3,1.1-VC3,1.3 VC3,2.1-VC3,2.3 VC4.2-VC4.4 VR1.2-VR1.4 VR2.2-VR2.4 = rcl:C-US: CAPACITOR, American symbol
ELECTRODES ELECTRODES1 ELECTRODES2 = pinhead:PINHD-1X8: PIN HEADER
ELECTRODES_P&N = pinhead:PINHD-1X18: PIN HEADER
J1 J2 = SparkFun-Connectors:AVR_SPI_PRG_6: AVR ISP 6 Pin This is the reduced ISP connector for AVR programming. Common on Arduino. This footprint will take up less PCB space and can be used with a 10-pin to 6-pin adapter such as SKU: BOB-08508 **Special note about "TEST_POINT" package. The stop mask is on the top side, so if you want your programming test points to be on the bottom of your board, make sure to place this package on the bottom side of the board. This also ensure that the orientation to program from the bottom side will be correct.
JP1-JP5 POWER_PIN = pinhead:PINHD-1X2: PIN HEADER
LED1 LED3-LED5 = SparkFun-LED:LED: LEDs Standard schematic elements and footprints for 5mm, 3mm, 1206, and 0603 sized LEDs. 5mm - Spark Fun Electronics SKU : COM-00529 (and others)
LM1117 = ads1299:LM1117: 800mA Low Dropout (LDO) Positive Regulator RAW, +3.3V; MPN: REG1117; OC_FARNELL: 1097566; OC_NEWARK: 14P6981
LM2663 = ads1299:LM2663
LP590725 = ads1299:LP5907: Ultra Low-Noise, 250-mA Linear Regulator for RF and Analog Circuits AVDD, +2.5V DVDD, +3.3V; MF: TEXAS INSTRUMENTS; MPN: TPS77025DBVR; OC_FARNELL: 1412881; OC_NEWARK: 77C1178
LP590733 = ads1299:LP5907: Ultra Low-Noise, 250-mA Linear Regulator for RF and Analog Circuits AVDD, +2.5V DVDD, +3.3V; MF: TEXAS INSTRUMENTS; MPN: TPS77033DBVT; OC_FARNELL: 8461570; OC_NEWARK: 77C1187
POWER_PLUG = con-jack:JACK-PLUG: DC POWER JACK Power Jack, DC, Right Angle, Through Hole, Rated 5A at 16VDC, PC Terminals Distributor: Farnell (www.Farnell.de) Drawing: 84N1161.pdf / 84N1162.pdf Manufacturer: SPC Technology (www.spctechnology.com) Type: SPC4077 / SPC 4078; OC_FARNELL: unknown; OC_NEWARK: unknown
R1-R24 R81-R83 = resistor:R-US_: RESISTOR, American symbol
R25-R66 = rcl:R-US_: RESISTOR, American symbol
TPS72325 = ads1299:TPS723XX: 200mA Low-Noise, High-PSRR Negative Output Low-Dropout Linear Regulators AVSS, -2.5V; MF: TEXAS INSTRUMENTS; MPN: TPS77025DBVR; OC_FARNELL: 1412881; OC_NEWARK: 77C1178
U1 U2 = SparkFun-DigitalIC:ATMEGA328_SMT: 32-Pin Atmega328 part Commonly used on Arduino compatible boards Available in QFP and QFN packages TQFP is IC-09069 QFN is non-stock; PROD_ID: IC-09069
U4 = SparkFun-Connectors:USD-SOCKET: microSD Socket Push-push type uSD socket. Schematic element and footprint production proven. Spark Fun Electronics SKU : PRT-00127. tDoc lines correctly indicate media card edge positions when inserting (unlocked, locked, depressed).
U5 = SparkFun-PowerIC:V_REG_317: Voltage Regulator Standard LM317 adjustable voltage regulator. AOI (Adjust Output Input). Google 'LM317 Calculator' for easy to use app to get the two resistor values needed. 240/720 for 5V output. 240/390 for 3.3V output. Spark Fun Electronics SKU : COM-00527
Y1 Y2 = SparkFun-FreqCtrl:CRYSTAL: Various standard crystals. Proven footprints. Spark Fun Electronics SKU : COM-00534